# EAGLE design Adjustable Positive SupplyV3Switch (EAGLE 7.2.0)
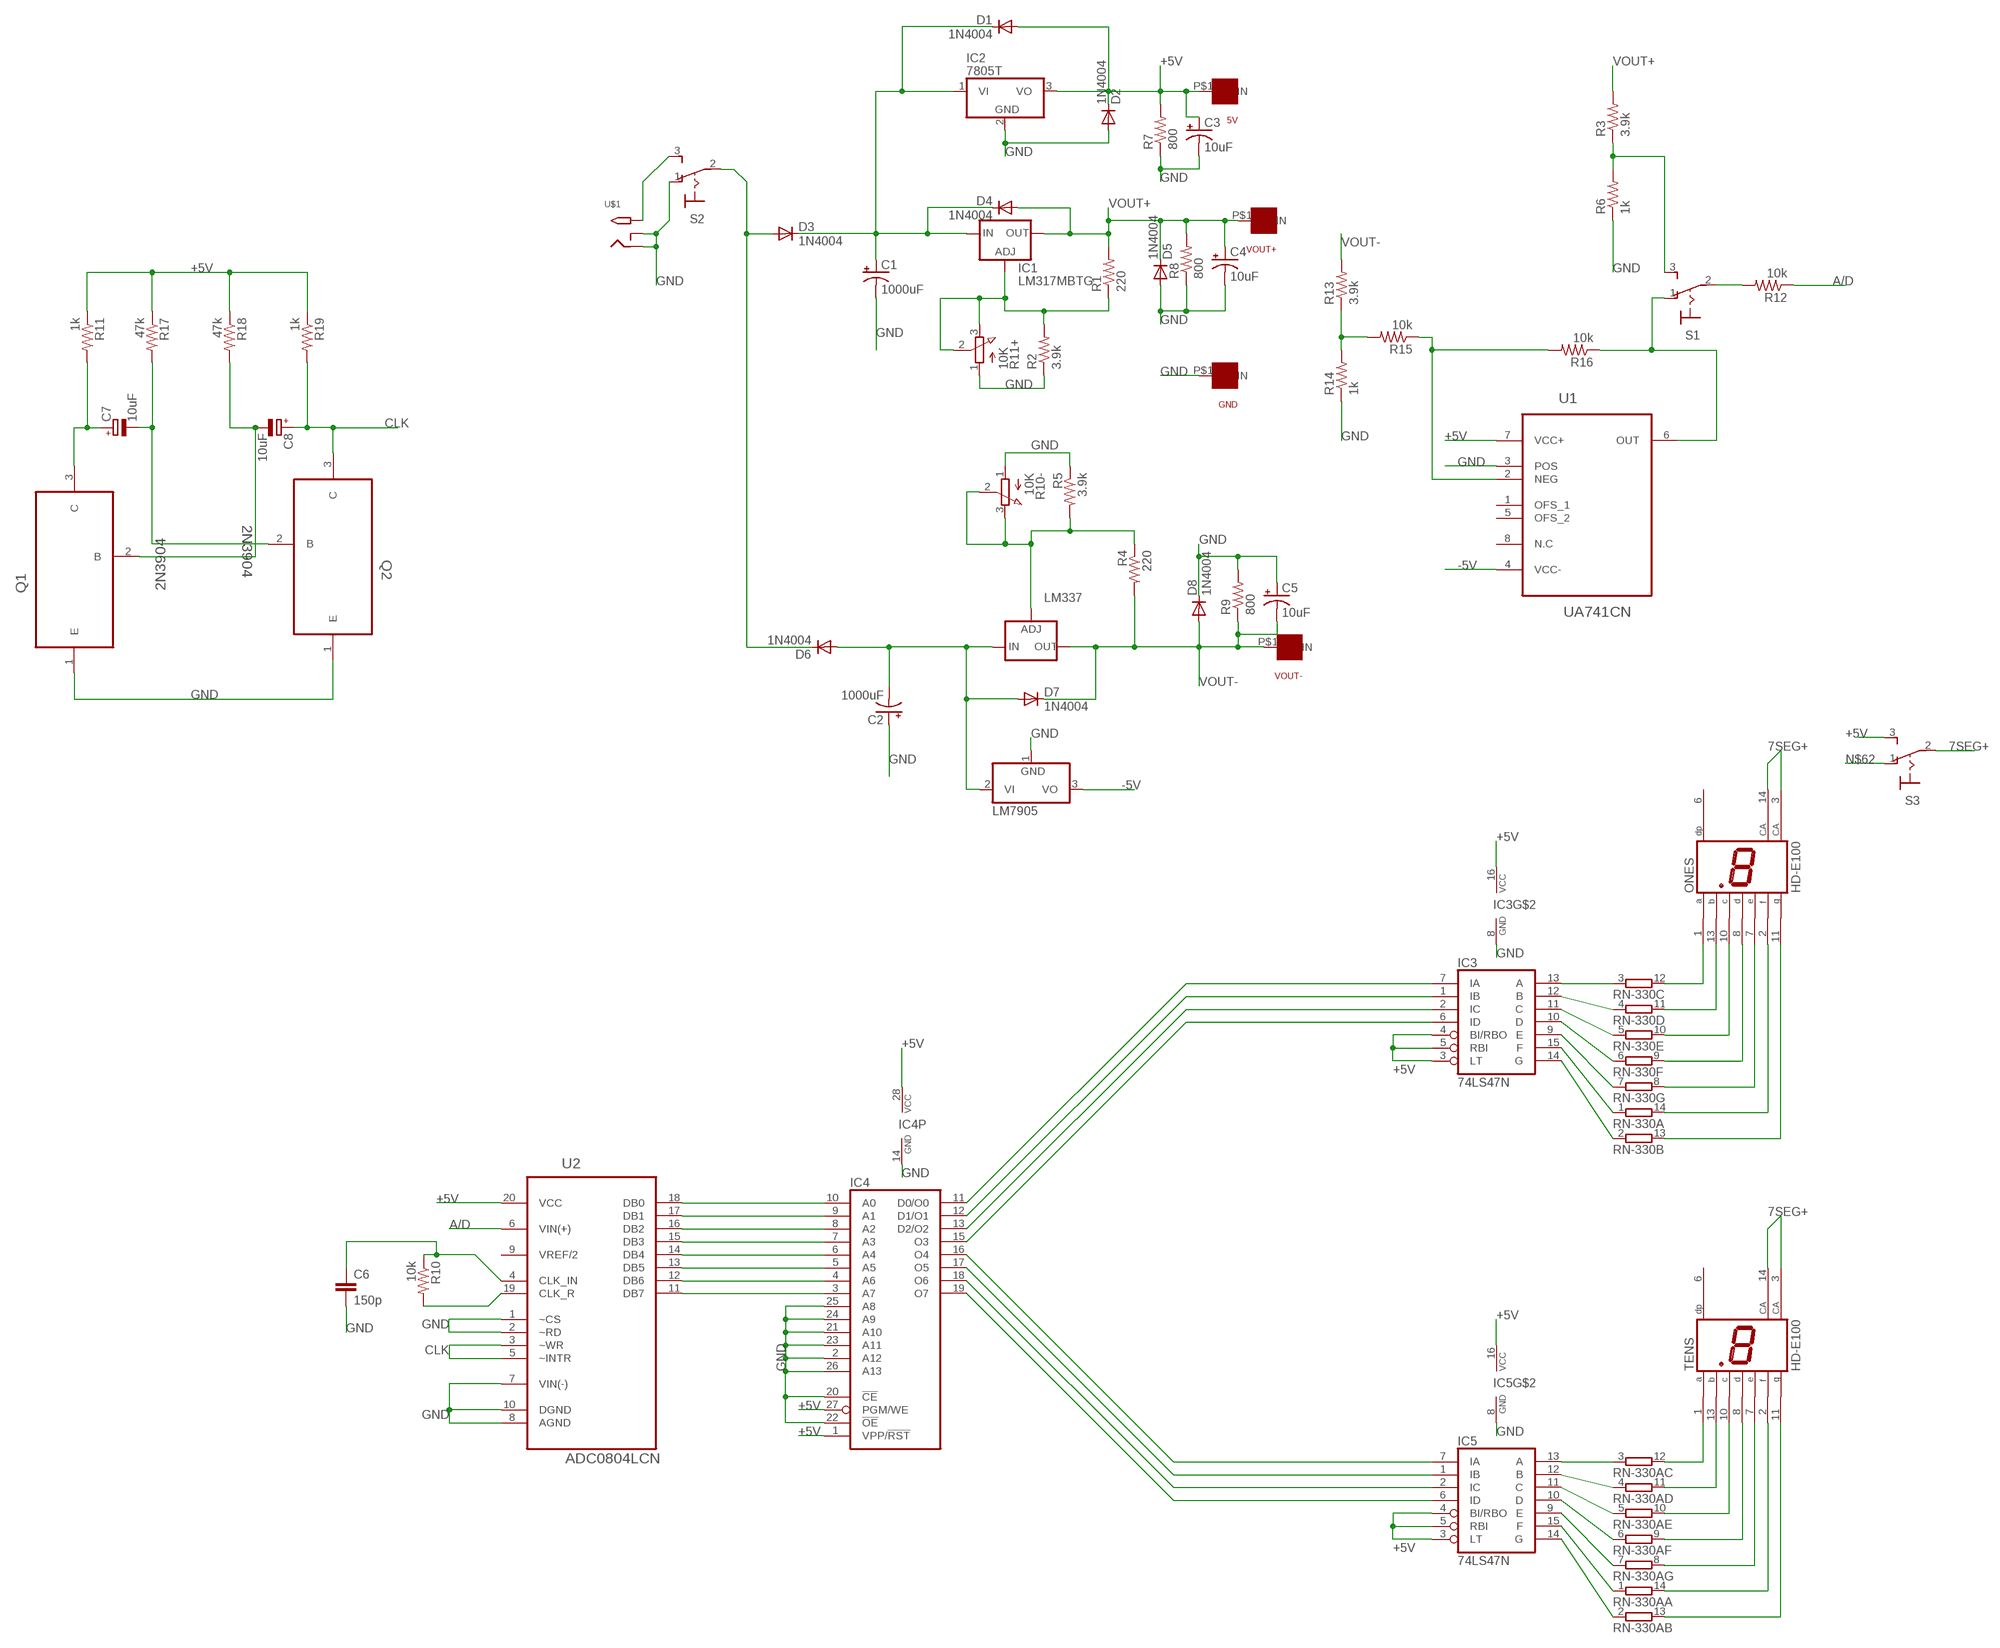
[diagram p0: schematic, sheet 1]

## Parts
5V  TURRENT_TERMINAL  [TURRET_CONNECTOR]
C1  1000uF  CPOL-USE7.5-16  [E7,5-16]
C2  1000uF  CPOL-USE7.5-16  [E7,5-16]
C3  10uF  CPOL-USE2.5-5  [E2,5-5]
C4  10uF  CPOL-USE2.5-5  [E2,5-5]
C5  10uF  CPOL-USE2.5-5  [E2,5-5]
C6  150p  C-EU025-025X050  [C025-025X050]
C7  10uF  CPOL-EUB45181B  [B45181B]
C8  10uF  CPOL-EUB45181B  [B45181B]
D1  1N4004  [DO41-10]
D2  1N4004  [DO41-10]
D3  1N4004  [DO41-10]
D4  1N4004  [DO41-10]
D5  1N4004  [DO41-10]
D6  1N4004  [DO41-10]
D7  1N4004  [DO41-10]
D8  1N4004  [DO41-10]
GND  TURRENT_TERMINAL  [TURRET_CONNECTOR]
IC1  LM317MBTG  [TO220L1]
IC2  7805T  [TO220H]
IC3  74LS47N  [DIL16]
IC4  27011  [DIL28]
IC5  74LS47N  [DIL16]
LM337  LM337TL  [337TL]
LM7905  7905T  [TO220H]
ONES  HD-E100  [HDSP-I]
Q1  2N3904  [TO254P508X877-3]
Q2  2N3904  [TO254P508X877-3]
R1  220  R-US_0411/15  [0411/15]
R2  3.9k  R-US_0411/15  [0411/15]
R3  3.9k  R-US_0411/15  [0411/15]
R4  220  R-US_0411/15  [0411/15]
R5  3.9k  R-US_0411/15  [0411/15]
R6  1k  R-US_0411/15  [0411/15]
R7  800  R-US_0411/15  [0411/15]
R8  800  R-US_0411/15  [0411/15]
R9  800  R-US_0411/15  [0411/15]
R10  10k  R-US_0411/15  [0411/15]
R10-  10K  EVUE2A  [EVUE]
R11  1k  R-US_0411/15  [0411/15]
R11+  10K  EVUE2A  [EVUE]
R12  10k  R-US_0411/15  [0411/15]
R13  3.9k  R-US_0411/15  [0411/15]
R14  1k  R-US_0411/15  [0411/15]
R15  10k  R-US_0411/15  [0411/15]
R16  10k  R-US_0411/15  [0411/15]
R17  47k  R-US_0411/15  [0411/15]
R18  47k  R-US_0411/15  [0411/15]
R19  1k  R-US_0411/15  [0411/15]
RN-330  7R-N  [DIL14]
RN-330A  7R-N  [DIL14]
S1  M9040P  [M9040P]
S2  M9040P  [M9040P]
S3  M9040P  [M9040P]
TENS  HD-E100  [HDSP-I]
U1  UA741CN  [DIP254P762X533-8]
U2  ADC0804LCN  [DIP254P762X508-20]
U$1  2.1MMJACKTHM  [PJ-102A]
VOUT+  TURRENT_TERMINAL  [TURRET_CONNECTOR]
VOUT-  TURRENT_TERMINAL  [TURRET_CONNECTOR]

## Nets
7SEG+: ONES.3(CA) ONES.14(CA) S3.2(P) TENS.3(CA) TENS.14(CA)
+5V [Power/GND]: 5V.P$1(IN) C3.+ D1.A D2.C IC2.3(VO) IC3.3(LT) IC3.4(BI/RBO) IC3.5(RBI) IC3.16(VCC) IC4.1(VPP/!RST) IC4.27(PGM/WE) IC4.28(VCC) IC5.3(LT) IC5.4(BI/RBO) IC5.5(RBI) IC5.16(VCC) R7.2 R11.1 R17.1 R18.1 R19.1 S3.3(S) U1.7(VCC+) U2.20(VCC)
-5V: LM7905.3(VO) U1.4(VCC-)
A/D: R12.1 U2.6(VIN(+))
CLK: C8.+ Q2.3(C) R19.2 U2.3(~WR) U2.5(~INTR)
GND [Power/GND]: C1.- C2.+ C3.- C4.- C5.+ C6.2 D2.A D5.A D8.C GND.P$1(IN) IC2.2(GND) IC3.8(GND) IC4.2(A12) IC4.14(GND) IC4.20(!CE) IC4.21(A10) IC4.22(!OE) IC4.23(A11) IC4.24(A9) IC4.25(A8) IC4.26(A13) IC5.8(GND) LM7905.1(GND) Q1.1(E) Q2.1(E) R2.1 R5.1 R6.1 R7.1 R8.1 R9.2 R10-.1(A) R11+.1(A) R14.1 S2.1(O) U1.3(POS) U2.1(~CS) U2.2(~RD) U2.7(VIN(-)) U2.8(AGND) U2.10(DGND) U$1.RING U$1.RING_SW
N$1: R12.2 S1.2(P)
N$2 [Power/GND]: D3.A D6.C S2.2(P)
N$3 [Power/GND]: C1.+ D1.C D3.C D4.C IC1.3(IN) IC2.1(VI)
N$4: IC1.1(ADJ) R1.1 R2.2 R11+.2(S) R11+.3(E)
N$5: R3.1 R6.2 S1.3(S)
N$6: LM337.1(ADJ) R4.1 R5.2 R10-.2(S) R10-.3(E)
N$7: R13.1 R14.2 R15.2
N$8: R15.1 R16.2 U1.2(NEG)
N$9 [Power/GND]: C2.- D6.A D7.A LM337.2(IN) LM7905.2(VI)
N$10: R16.1 S1.1(O) U1.6(OUT)
N$11: IC4.16(O4) IC5.7(IA)
N$12: IC4.18(O6) IC5.2(IC)
N$13: IC4.19(O7) IC5.6(ID)
N$14: IC3.7(IA) IC4.11(D0/O0)
N$15: IC3.1(IB) IC4.12(D1/O1)
N$16: IC3.2(IC) IC4.13(D2/O2)
N$17: IC3.6(ID) IC4.15(O3)
N$18: IC3.15(F) RN-330.1
N$19: IC3.14(G) RN-330.2
N$20: IC3.13(A) RN-330.3
N$21: IC3.12(B) RN-330.4
N$22: IC3.11(C) RN-330.5
N$23: IC3.10(D) RN-330.6
N$24: IC3.9(E) RN-330.7
N$25: ONES.1(A) RN-330.12
N$26: ONES.13(B) RN-330.11
N$27: ONES.10(C) RN-330.10
N$28: ONES.8(D) RN-330.9
N$29: ONES.7(E) RN-330.8
N$30: RN-330A.8 TENS.7(E)
N$31: ONES.2(F) RN-330.14
N$32: IC5.15(F) RN-330A.1
N$33: IC5.14(G) RN-330A.2
N$34: IC5.13(A) RN-330A.3
N$35: IC5.12(B) RN-330A.4
N$36: ONES.11(G) RN-330.13
N$37: IC5.11(C) RN-330A.5
N$38: IC5.10(D) RN-330A.6
N$39: IC5.9(E) RN-330A.7
N$40: IC4.17(O5) IC5.1(IB)
N$41: RN-330A.12 TENS.1(A)
N$42: RN-330A.11 TENS.13(B)
N$43: RN-330A.10 TENS.10(C)
N$44: RN-330A.9 TENS.8(D)
N$45: RN-330A.14 TENS.2(F)
N$46: RN-330A.13 TENS.11(G)
N$47: IC4.10(A0) U2.18(DB0)
N$48: IC4.9(A1) U2.17(DB1)
N$49: IC4.8(A2) U2.16(DB2)
N$50: IC4.7(A3) U2.15(DB3)
N$51: IC4.6(A4) U2.14(DB4)
N$52: IC4.5(A5) U2.13(DB5)
N$53: IC4.4(A6) U2.12(DB6)
N$54: IC4.3(A7) U2.11(DB7)
N$55: R10.2 U2.19(CLK_R)
N$56: C6.1 R10.1 U2.4(CLK_IN)
N$57: C7.+ Q1.3(C) R11.2
N$58: C7.- Q2.2(B) R17.2
N$59 [Power/GND]: S2.3(S) U$1.TIP
N$60: C8.- Q1.2(B) R18.2
N$62: S3.1(O)
VOUT+ [Power/GND]: C4.+ D4.A D5.C IC1.2(OUT) R1.2 R3.2 R8.2 VOUT+.P$1(IN)
VOUT- [Power/GND]: C5.- D7.C D8.A LM337.3(OUT) R4.2 R9.1 R13.2 VOUT-.P$1(IN)
Unconnected: ONES.6(DP) TENS.6(DP) U1.1(OFS_1) U1.5(OFS_2) U1.8(N.C) U2.9(VREF/2)

## Library data of the parts
5V GND VOUT+ VOUT- = MyDevices:TURRENT_TERMINAL
C1 C2 = adafruit:CPOL-US: POLARIZED CAPACITOR, American symbol
C3-C5 = rcl:CPOL-US: POLARIZED CAPACITOR, American symbol
C6 = rcl:C-EU: CAPACITOR, European symbol
C7 C8 = rcl:CPOL-EU: POLARIZED CAPACITOR, European symbol
D1-D8 = adafruit:1N4004: DIODE General purpose 1N400x type rectifier (With bigger pads) http://www.ladyada.net/library/pcb/eaglelibrary.html
IC1 = v-reg:LM317?*: 500 mA Adjustable Output Positive Voltage Regulator Source: http://www.onsemi.co.jp .. LM317M-D.PDF
IC2 = adafruit:78*: Positive VOLTAGE REGULATOR Added bigger pads to the TO-92 package
IC3 IC5 = 74xx-eu:74*47: BCD to seven segment DECODER/DRIVER Source: http://www.ee.washington.edu/stores/DataSheets/74ls/74ls47.pdf
IC4 = memory:27011: MEMORY
LM337 = v-reg:LM337TL: VOLTAGE REGULATOR
LM7905 = linear:79*: Negative VOLTAGE REGULATOR
ONES TENS = display-hp:HD-E100: LED DISPLAY 1-character 7 segment, decimal point left; OC_FARNELL: unknown; OC_NEWARK: unknown
Q1 Q2 = Fairchild_By_element14_Batch_1:2N3904: NPN General Purpose Amplifier; MPN: 2N3904; OC_FARNELL: 9846743; OC_NEWARK: -; PACKAGE: TO-92; SUPPLIER: Fairchild
R1-R19 = adafruit:R-US_: RESISTOR, American symbol
R10- R11+ = pot:EVU: 9 mm Square Rotary Potentiometers Source: Panasonic
RN-330 RN-330A = resistor-dil:7R-N: DIL RESISTOR; OC_FARNELL: unknown; OC_NEWARK: unknown
S1-S3 = switch:M9040P: TOGGLE SWITCH Marquardt
U1 = ST Microelctronics_By_element14_Batch_1:UA741CN: operational amplifiers; MPN: UA741CN; OC_FARNELL: 1094414; OC_NEWARK: 89K1126; PACKAGE: DIP; SUPPLIER: STMICROELECTRONICS
U2 = NSC_By_element14_Batch_1.1:ADC0804LCN: A/D Converter; MPN: ADC0804LCN; OC_FARNELL: 9486593; OC_NEWARK: 07B4596; PACKAGE: 20-DIP; SUPPLIER: National Semiconductor
U$1 = adafruit:2.1MMJACK: 2.1mm x 5.5mm THM DC jack with internal switch. Digikey part #PJ-102A, 4UCON part #05537 2.1mm x 5.5mm SMT DC jack with internal switch. Digikey part #PJ-002A-SMT, 4UCON part #03267 By microbuilder.eu & adafruit.com

## Net classes
1 Power/GND: width 0.508 mm, clearance 0.254 mm

## Board
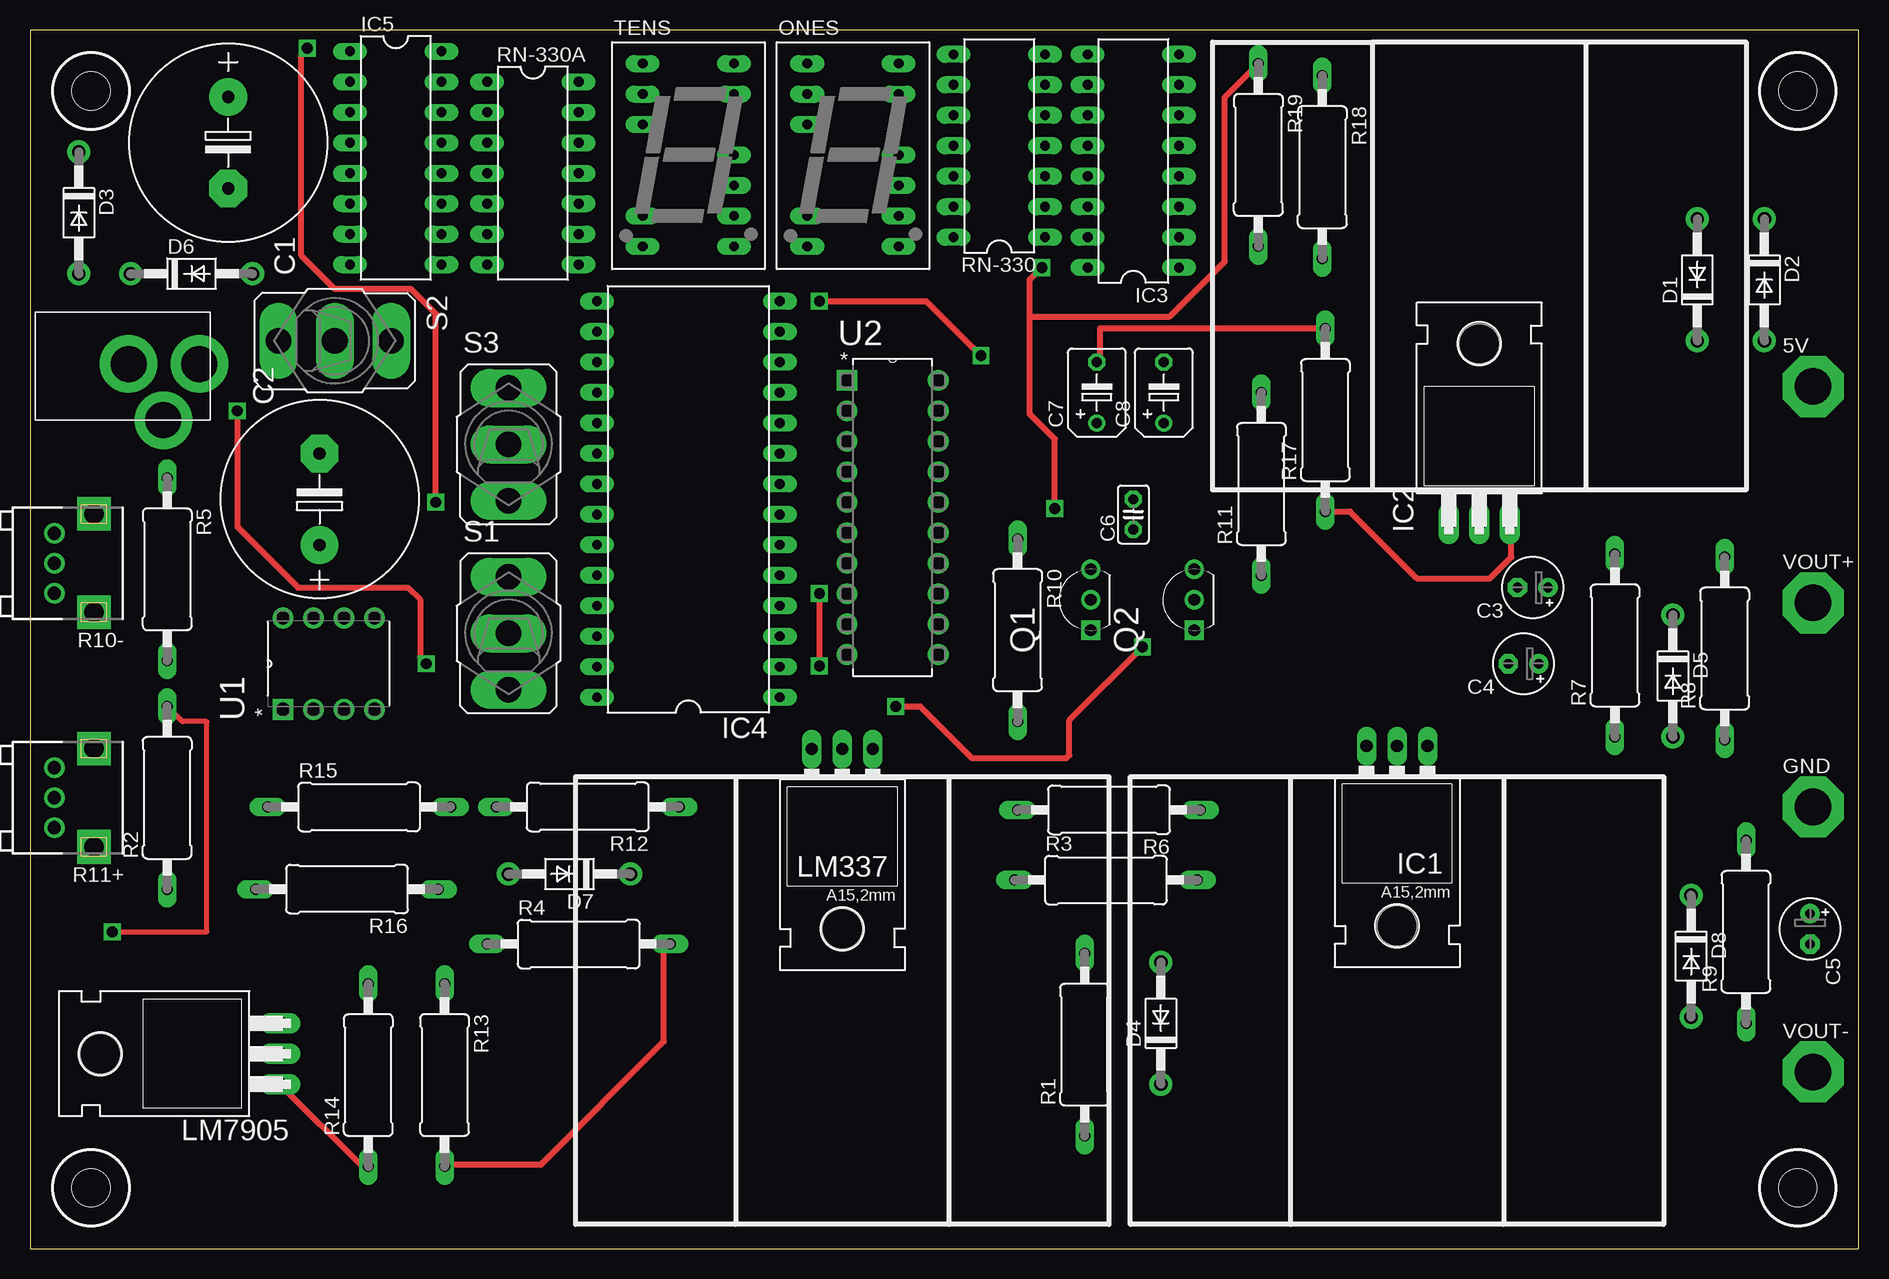
[diagram p1: board, top side]
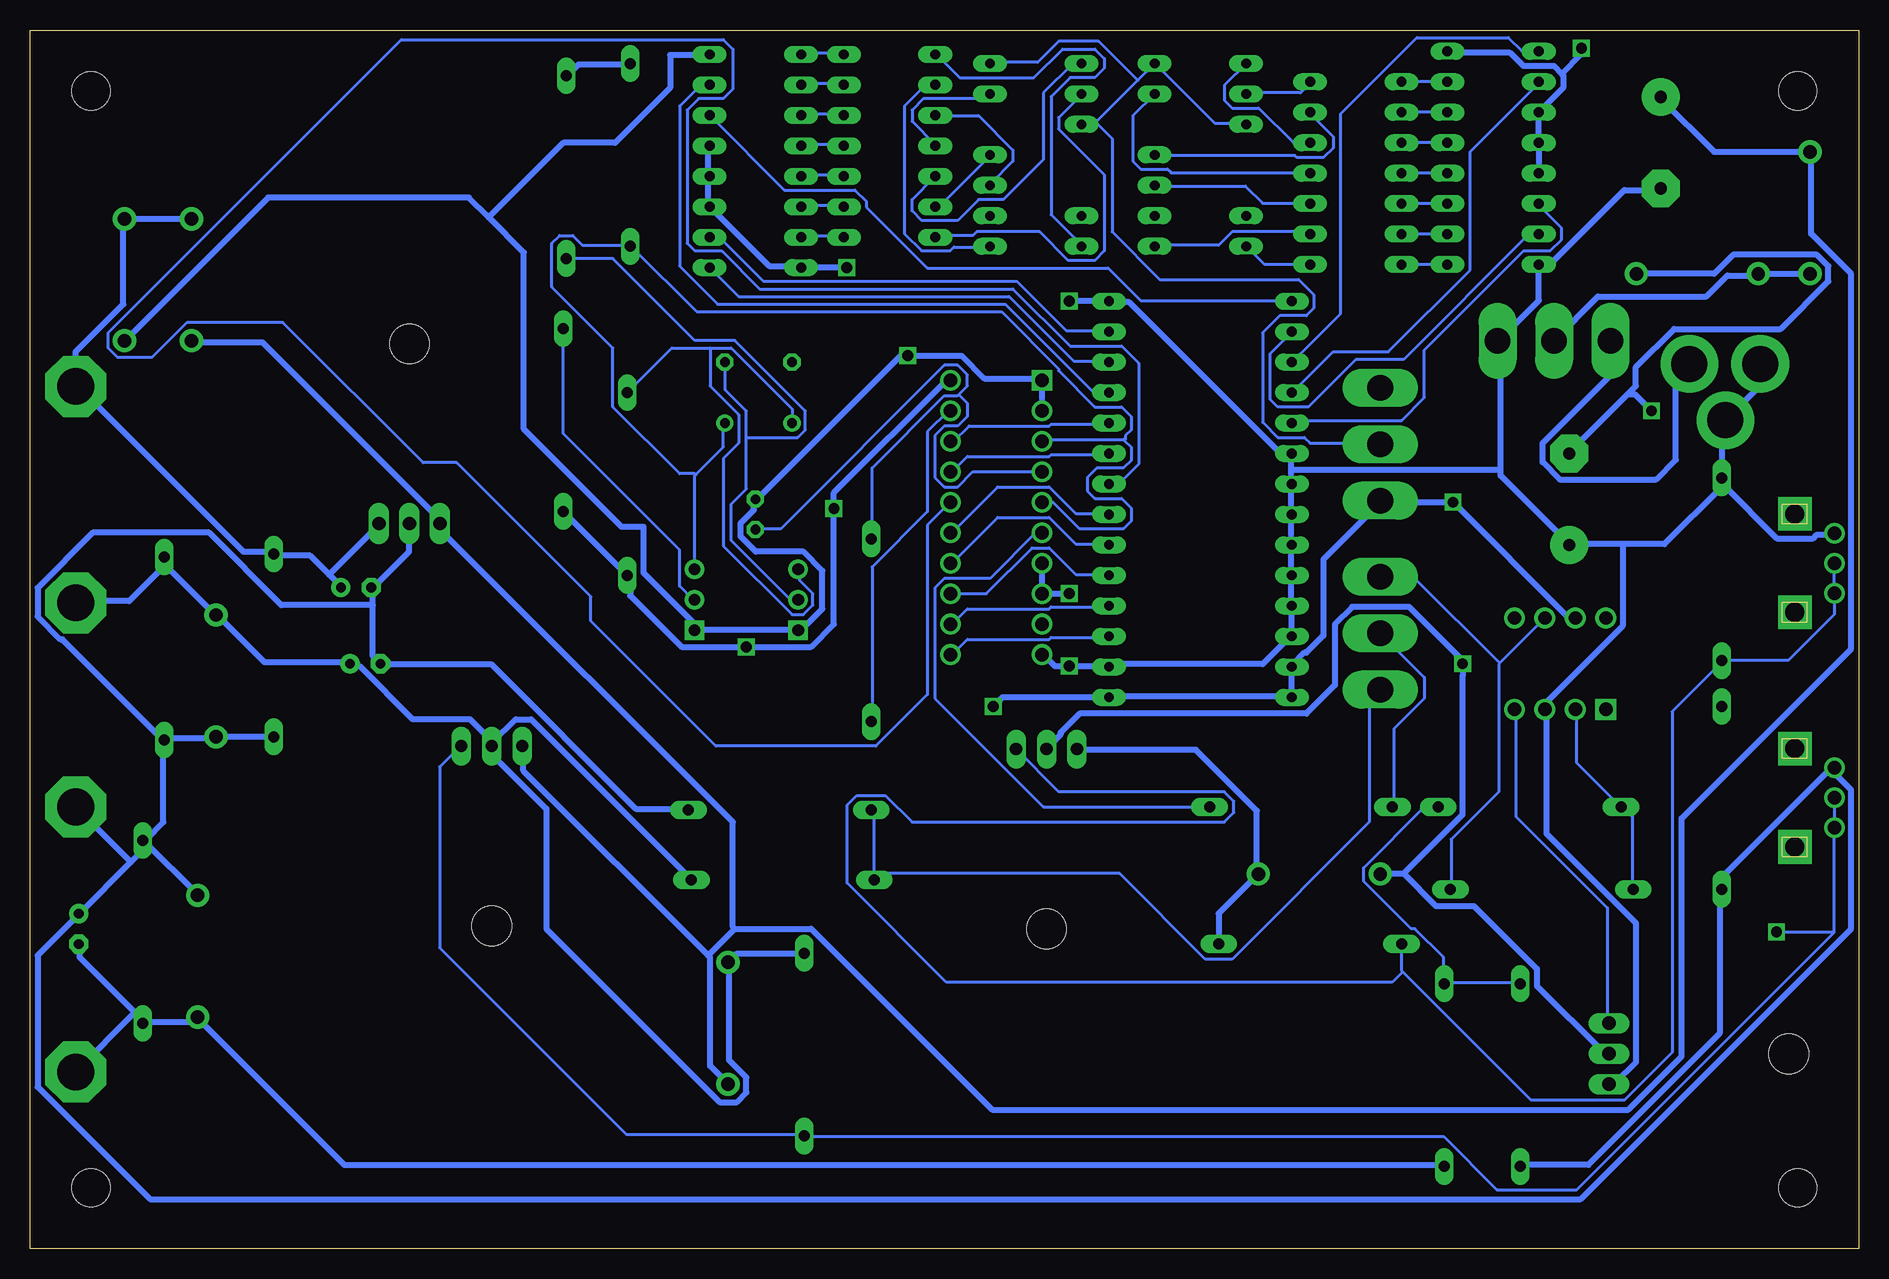
[diagram p2: board, bottom side, seen from below]

Size 152.4 x 101.6 mm. Coordinates in mm from the lower left corner, seen from the top.
Outline: 0,0 152.4,0 152.4,101.6 0,101.6 0,0
Copper layers (1*16): Top 0.035mm / dielectric 1.5mm / Bottom 0.035mm
Design rules "SparkFun *": minimum track width 10mil, minimum drill 20mil, track to track 15mil, track to pad 10mil, pad to pad 8mil, via to via 10mil, smd to smd 8mil, copper to edge 10mil, drill to drill 8mil, minimum pad ring 12mil, minimum via ring 10mil, stop-mask expansion 4mil, vias tented up to drill 25mil, thermal gap 10mil
Holes 3.17 mm at 147.32,5.08 5.08,5.08 5.08,96.52 147.32,96.52
tRestrict: area 58.4,2.5 to 77.5,39.4; area 104.1,2.5 to 123.2,39.4; area 111.8,63.5 to 129.5,100.3

### Footprints (pad centres in the part's own frame; a part is rotated, then mirrored left to right if it is on the bottom)
TURRET_CONNECTOR = drill 3.048 pad 5.08 octagon: P$1 0,0
E7,5-16 = drill 1.016 pad 3.15: + -3.81,0 | drill 1.016 pad 3.15 octagon: - 3.81,0
E2,5-5 = drill 0.813 pad 1.6: + -1.27,0 | drill 0.813 pad 1.6 octagon: - 1.27,0
C025-025X050 = drill 0.813 octagon: 1 -1.27,0; 2 1.27,0
B45181B = drill 0.813: + -2.54,0 | drill 0.813 octagon: - 2.54,0
DO41-10 = drill 1.118 pad 1.93: A 5.08,0; C -5.08,0
TO220L1 = drill 1.016 long: 1 -2.54,-3.81; 2 0,-3.81; 3 2.54,-3.81 | hole 3.302: 0,11.176
TO220H = drill 1.118 long: 1 -2.54,-10.16; 2 0,-10.16; 3 2.54,-10.16 | hole 3.302: 0,4.826
DIL16 = drill 0.813 long: 1 -8.89,-3.81; 2 -6.35,-3.81; 3 -3.81,-3.81; 4 -1.27,-3.81; 5 1.27,-3.81; 6 3.81,-3.81; 7 6.35,-3.81; 8 8.89,-3.81; 9 8.89,3.81; 10 6.35,3.81; 11 3.81,3.81; 12 1.27,3.81; 13 -1.27,3.81; 14 -3.81,3.81; 15 -6.35,3.81; 16 -8.89,3.81
DIL28 = drill 0.813 long: 1 -16.51,-7.62; 2 -13.97,-7.62; 3 -11.43,-7.62; 4 -8.89,-7.62; 5 -6.35,-7.62; 6 -3.81,-7.62; 7 -1.27,-7.62; 8 1.27,-7.62; 9 3.81,-7.62; 10 6.35,-7.62; 11 8.89,-7.62; 12 11.43,-7.62; 13 13.97,-7.62; 14 16.51,-7.62; 15 16.51,7.62; 16 13.97,7.62; 17 11.43,7.62; 18 8.89,7.62; 19 6.35,7.62; 20 3.81,7.62; 21 1.27,7.62; 22 -1.27,7.62; 23 -3.81,7.62; 24 -6.35,7.62; 25 -8.89,7.62; 26 -11.43,7.62; 27 -13.97,7.62; 28 -16.51,7.62
337TL = drill 1.016 long: 1 -2.54,-3.81; 2 0,-3.81; 3 2.54,-3.81 | hole 3.302: 0,11.176
HDSP-I = drill 0.813 long: 1 -3.81,7.62; 2 -3.81,5.08; 3 -3.81,2.54; 6 -3.81,-5.08; 7 -3.81,-7.62; 8 3.81,-7.62; 9 3.81,-5.08; 10 3.81,-2.54; 11 3.81,0; 13 3.81,5.08; 14 3.81,7.62
TO254P508X877-3 = drill 0.991 square: 1 -5.08,0 | drill 0.991: 2 -2.54,0; 3 0,0
0411/15 = drill 0.914 long: 1 -7.62,0; 2 7.62,0
EVUE = drill 1.1 pad 1.676: 1 0,-2.5; 2 0,0; 3 0,2.5 | drill 1.6 pad 2.8 square: M1 -3.3,4.1; M2 -3.3,-4.1
DIL14 = drill 0.813 long: 1 -7.62,-3.81; 2 -5.08,-3.81; 3 -2.54,-3.81; 4 0,-3.81; 5 2.54,-3.81; 6 5.08,-3.81; 7 7.62,-3.81; 8 7.62,3.81; 9 5.08,3.81; 10 2.54,3.81; 11 0,3.81; 12 -2.54,3.81; 13 -5.08,3.81; 14 -7.62,3.81
M9040P = drill 2.134 long: 1 0,4.699; 2 0,0; 3 0,-4.699
DIP254P762X533-8 = drill 1.118 square: 1 -7.62,7.62 | drill 1.118: 2 -7.62,5.08; 3 -7.62,2.54; 4 -7.62,0; 5 0,0; 6 0,2.54; 7 0,5.08; 8 0,7.62
DIP254P762X508-20 = drill 1.118 square: 1 -7.62,22.86 | drill 1.118: 2 -7.62,20.32; 3 -7.62,17.78; 4 -7.62,15.24; 5 -7.62,12.7; 6 -7.62,10.16; 7 -7.62,7.62; 8 -7.62,5.08; 9 -7.62,2.54; 10 -7.62,0; 11 0,0; 12 0,2.54; 13 0,5.08; 14 0,7.62; 15 0,10.16; 16 0,12.7; 17 0,15.24; 18 0,17.78; 19 0,20.32; 20 0,22.86
PJ-102A = drill 3 pad 4.8: RING 0.1,-3.39; RING_SW -4.6,-6.29; TIP 0.1,-9.29

### Placement (x,y rotation side)
5V  148.59,71.88 0 top
C1  16.51,92.2 270 top
C2  24.13,62.48 90 top
C3  125.22,55.12 180 top
C4  124.46,48.77 180 top
C5  148.34,26.67 270 top
C6  91.95,61.21 90 top
C7  88.9,71.37 90 top
C8  94.49,71.37 90 top
D1  138.94,80.77 90 top
D2  144.53,80.77 270 top
D3  4.06,86.36 270 top
D4  94.23,18.8 90 top
D5  136.91,47.75 270 top
D6  13.46,81.28 0 top
D7  44.96,31.24 180 top
D8  138.43,24.38 270 top
GND  148.59,36.83 0 top
IC1  113.92,38.1 180 top
IC2  120.78,70.61 0 top
IC3  91.95,90.68 90 top
IC4  54.86,62.48 90 top
IC5  30.48,90.93 270 top
LM337  67.69,37.85 180 top
LM7905  10.67,16.26 90 top
ONES  68.58,91.19 0 top
Q1  88.39,56.64 90 top
Q2  97.03,56.64 90 top
R1  87.88,17.02 90 top
R2  11.43,37.59 90 top
R3  89.66,30.73 0 top
R4  45.72,25.4 0 top
R5  11.43,56.64 270 top
R6  89.92,36.58 180 top
R7  132.08,50.29 90 top
R8  141.22,50.04 90 top
R9  143,26.42 90 top
R10  82.3,51.56 270 top
R10-  2.03,57.15 180 top
R11  102.62,63.75 90 top
R11+  2.03,37.59 180 top
R12  46.48,36.83 180 top
R13  34.54,14.48 270 top
R14  28.19,14.48 90 top
R15  27.43,36.83 0 top
R16  26.42,29.97 180 top
R17  107.95,69.09 90 top
R18  107.7,90.17 270 top
R19  102.36,91.19 270 top
RN-330  80.77,91.95 90 top
RN-330A  41.91,89.66 270 top
S1  39.88,51.31 0 top
S2  25.4,75.69 270 top
S3  39.88,67.06 0 top
TENS  54.86,91.19 0 top
U1  28.7,52.58 90 top
U2  75.69,49.53 0 top
U$1  4.83,73.66 90 top
VOUT+  148.59,53.85 0 top
VOUT-  148.59,14.73 0 top

### Tracks (layer width: path | path; a pad name or v marks a point on that pad's centre or on a via)
7SEG+
  Bottom 0.254: TENS.3 51.12,93.82 53.66,93.82 58.58,98.74 TENS.14 60.09,97.39 | 60.09,97.39 63.66,93.82 64.77,93.82 ONES.3 63.5,93.82 62.23,92.55 62.23,84.77 58.26,80.8 46.67,80.8 45.4,79.53 45.4,78.42 46.04,77.79 48.26,77.79 49.69,76.36 49.69,68.9 48.42,67.63 46.2,67.63 45.72,67.15 40.01,67.15 S3.2 | 60.09,97.39 63.34,100.65 66.67,100.65 68.42,98.9 72.39,98.9 ONES.14
+5V  (via drill 0.9)
  Top 0.508: v33.81,62.23 33.81,77.95 31.75,80.01 25.4,80.01 22.61,82.8 22.61,99.57 v23.11,100.08 | v72.14,45.21 74.17,45.21 78.49,40.89 86.36,40.89 86.61,41.15 86.61,44.07 v92.71,50.16 | v85.41,61.7 85.41,67.5 83.31,69.6 83.31,77.72 | 83.31,77.72 83.31,80.77 v84.33,81.79 | R17.1 109.98,61.47 115.57,55.88 121.67,55.88 123.44,57.66 123.44,60.33 IC2.3 | 83.31,77.72 95,77.72 99.57,82.3 99.57,96.01 R19.1
  Bottom 0.508: 127.48,56.2 126.52,55.24 C3.+ | 127.48,56.2 129.06,57.78 132.08,57.78 R7.2 132.24,58.1 134.62,58.1 148.43,71.91 5V.P$1 148.59,74.77 144.62,78.74 144.62,85.72 D2.C 144.46,85.88 139.06,85.88 D1.A | 127.48,56.2 123.35,60.33 IC2.3 | R17.1 107.95,61.44 102.71,56.2 R11.1 102.39,56.04 102.39,54.45 98.11,50.16 v92.71,50.16 87.31,50.16 85.41,52.07 v85.41,61.7 85.41,63.02 76.04,72.39 U2.20 | U1.7 23.65,52.7 24.29,52.7 v33.81,62.23 39.85,62.23 S3.3 40.01,62.07 44.61,57.47 44.61,51.12 46.04,49.69 46.2,49.69 47.15,48.74 IC4.27 47.31,48.42 47.31,46.04 IC4.28 47.47,46.04 62.39,46.04 IC4.1 71.37,45.97 v72.14,45.21 | IC5.5 IC5.4 IC5.3 26.51,94.93 24.61,96.84 24.61,97.79 24.75,97.93 | 24.75,97.93 25.4,98.58 27.94,98.58 29.05,99.69 34.29,99.69 IC5.16 | IC3.5 95.89,91.92 95.89,89.53 IC3.4 95.89,89.38 95.89,87 IC3.3 90.81,81.92 88.27,81.92 IC3.16 v84.33,81.79 | R19.1 102.39,98.74 106.68,98.74 107.63,97.79 R18.1 | v23.11,100.08 23.11,99.57 24.75,97.93
-5V
  Bottom 0.254: LM7905.3 20.95,18.89 20.95,28.42 28.57,36.04 28.57,44.93 U1.4
A/D
  Bottom 0.254: R12.1 67.94,36.83 76.99,45.88 76.99,55.09 76.2,55.88 72.39,55.88 68.58,59.69 U2.6
CLK
  Bottom 0.254: U2.5 67.15,62.23 64.93,60.01 61.28,60.01 60.64,60.64 60.64,61.75 61.44,62.55 63.66,62.55 64.29,63.18 64.29,64.29 63.5,65.09 61.28,65.09 60.64,65.72 60.64,66.83 61.2,67.39 | 61.2,67.39 61.28,67.47 67.79,67.47 67.94,67.31 U2.3 | 96.92,64.53 97,64.45 97,56.67 Q2.3 | 96.92,64.53 94.61,66.83 94.61,68.74 C8.+ | 96.92,64.53 97,64.61 98.27,64.61 103.82,70.17 103.82,75.09 108.9,80.17 108.9,83.82 108.27,84.45 107.16,84.45 106.36,83.66 102.39,83.66 R19.2 102.23,83.5 96.84,78.11 71.44,78.11 66.67,73.34 66.67,73.18 63.66,70.17 61.44,70.17 60.64,69.37 60.64,68.26 61.12,67.79 61.12,67.47 61.2,67.39
GND  (via drill 0.9)
  Top 0.508: R14.1 27.69,6.86 LM7905.1 | v65.79,54.61 v65.79,48.58 | v65.79,78.99 74.71,78.99 v79.25,74.45
  Bottom 0.508: U2.7 68.1,57.15 68.1,54.61 U2.8 v65.79,54.61 | U2.10 67.94,49.53 66.99,48.58 v65.79,48.58 62.55,48.58 IC4.2 62.39,48.74 49.69,48.74 47.47,50.96 IC4.26 47.31,51.12 47.31,53.5 IC4.25 47.31,53.82 47.31,56.04 IC4.24 47.31,56.36 47.31,58.58 IC4.23 47.31,58.9 47.31,61.12 IC4.22 47.31,61.44 47.31,63.66 IC4.21 47.31,63.98 47.31,64.93 | 47.31,64.93 47.31,66.2 IC4.20 47.47,66.36 48.26,66.36 60.8,78.9 62.39,78.9 IC4.14 v65.79,78.99 | LM7905.1 20.8,13.81 20.32,13.81 18.57,15.56 18.57,27.15 26.04,34.61 26.04,44.93 U1.3 25.88,45.09 25.88,45.72 19.68,51.91 19.68,58.74 | C1.- 16.51,88.27 19.53,88.27 25.56,82.23 26.51,82.23 IC5.8 26.67,79.06 30,75.72 S2.1 29.84,75.56 29.84,64.93 | R5.1 11.43,68.9 11.27,69.06 U$1.RING_SW 10.95,69.22 8.26,71.91 8.26,73.66 U$1.RING | R10-.1 2.06,59.53 3.49,59.53 3.81,59.21 6.83,59.21 11.27,63.66 11.27,64.14 R5.1 | 19.68,58.74 16.19,58.74 11.43,63.5 R5.1 | 19.68,58.74 24.13,58.74 C2.+ 24.29,58.9 29.84,64.45 29.84,64.93 | 29.84,64.93 47.31,64.93 | R14.1 28.1,6.99 22.54,6.99 11.59,17.94 11.59,29.84 R2.1 11.43,30.96 2.38,40.01 2.06,40.01 R11+.1 1.91,39.85 1.91,39.53 0.64,38.26 0.64,26.67 23.18,4.13 142.4,4.13 151.76,13.49 151.76,24.45 148.43,27.78 C5.+ 148.27,27.94 143.99,32.23 | R8.1 141.13,42.55 137,42.55 D5.A 136.68,42.7 132.08,42.7 R7.1 | R9.2 142.88,33.97 138.43,29.53 D8.C | 143.99,32.23 142.72,33.5 R9.2 | R8.1 141.29,42.23 141.29,35.56 142.72,34.13 R9.2 | 143.99,32.23 GND.P$1 | R6.1 97.63,36.67 101.92,36.67 113.98,48.74 123.19,48.74 C4.- 123.35,48.9 123.83,49.37 123.83,53.66 | 123.83,53.66 123.83,55.09 C3.- 123.67,55.24 120.81,58.1 120.81,60.33 IC2.2
  Bottom 0.508: 123.83,53.66 131.44,53.66 137.48,59.69 147.16,59.69 151.76,55.09 151.76,52.7 149.86,50.8 149.7,50.8 141.45,42.55 R8.1 | U2.2 68.1,69.85 68.1,72.39 U2.1 68.26,72.55 72.87,72.55 74.77,74.45 v79.25,74.45 79.85,74.45 91.76,62.55 C6.2 92.08,62.39 92.08,61.59 93.19,60.48 93.19,59.37 91.92,58.1 87.95,58.1 86.36,56.52 86.36,53.34 88.27,51.44 Q1.1 88.58,51.59 97,51.59 Q2.1 97.16,51.75 97.16,52.23 101.28,56.36 101.28,60.17 103.09,60.17 111.25,68.33 111.25,83.06 114.17,85.98 | IC3.8 95.89,99.54 99.06,99.54 99.06,96.77 103.63,92.2 107.95,92.2 114.17,85.98 | D2.A 144.46,75.72 132.56,87.63 115.82,87.63 114.17,85.98
N$1
  Bottom 0.254: S1.2 36.2,47.62 36.2,45.88 38.73,43.34 38.73,36.83 R12.2
N$2
  Bottom 0.508: D3.A D6.C 8.57,81.12 10.95,81.12 12.7,79.38 21.75,79.38 25.4,75.72 S2.2
N$3
  Bottom 0.508: D1.C 138.91,75.56 133.03,75.56 118.27,60.8 118.27,60.48 IC2.1 118.11,60.33 118.11,59.85 93.82,35.56 93.82,26.83 93.66,26.67 | C1.+ 16.51,95.89 12.06,91.44 D3.C 3.97,91.28 3.97,84.61 0.64,81.28 0.64,50.01 14.76,35.88 14.76,16.03 19.21,11.59 72.23,11.59 87.31,26.67 93.66,26.67 | 95.89,24.45 95.73,24.29 95.73,15.24 94.3,13.81 D4.C | 95.89,24.45 111.28,39.85 111.28,41.91 IC1.3 | 95.89,24.45 93.66,26.67
N$4  (via drill 0.9)
  Top 0.406: v6.86,26.42 14.73,26.42 14.73,43.94 12.7,43.94 R2.2
  Bottom 0.254: R11+.2 2.06,37.47 2.06,35.24 R11+.3 2.06,35.08 2.06,26.35 | IC1.1 116.52,41.91 118.27,40.16 118.27,25.08 102.71,9.53 87.95,9.53 R1.1 87.79,9.37 34.61,9.37 30.16,4.92 23.5,4.92 2.06,26.35 | 2.06,26.35 6.86,26.35
  Bottom 0.406: 6.86,26.35 v6.86,26.42
N$5
  Bottom 0.254: 82.07,31.27 82.07,36.35 R6.2 | 82.07,31.27 82.07,30.8 R3.1 82.07,31.27 | 82.07,31.27 61.59,31.27 54.45,24.13 52.23,24.13 40.8,35.56 40.8,45.72 40.01,46.51 S1.3
N$6
  Bottom 0.254: R4.1 38.1,23.18 38.02,23.1 | 38.02,23.1 27.3,12.38 19.53,12.38 15.56,16.35 15.56,44.77 11.43,48.9 R5.2 11.43,49.05 5.87,49.05 2.06,52.86 2.06,54.61 R10-.3 2.06,54.77 2.06,57.15 R10-.2 | LM337.1 66.67,38.1 52.86,38.1 52.07,37.31 52.07,36.35 52.86,35.56 78.9,35.56 81.12,37.78 83.5,37.78 84.3,36.99 84.3,30.48 76.04,22.23 38.89,22.23 38.02,23.1
N$7
  Bottom 0.254: R14.2 28.26,22.23 34.45,22.23 R13.1 34.61,22.23 34.61,24.29 36.99,26.67 37.31,26.67 41.27,30.64 41.27,31.75 36.2,36.83 R15.2
N$8
  Bottom 0.254: R16.2 18.89,30 18.89,36.04 19.68,36.83 R15.1 19.84,36.83 23.5,40.48 23.5,44.93 U1.2
N$9  (via drill 0.9)
  Top 0.508: v17.27,69.85 17.27,60.2 22.35,55.12 31.5,55.12 32.51,54.1 32.51,49.28 v33.02,48.77
  Bottom 0.508: 37.94,31.27 33.02,36.2 33.02,47.75 v33.02,48.77 33.02,49.05 37.47,53.5 42.23,53.5 43.66,52.07 43.66,46.99 46.04,44.61 64.93,44.61 66.52,43.02 66.52,42.86 67.63,41.75 LM337.2 | 37.94,31.27 39.85,31.27 D7.A | 37.94,31.27 35.24,28.57 32.07,28.57 26.83,23.34 26.83,21.91 21.27,16.35 20.95,16.35 LM7905.2 | D6.A 12.06,81.28 10.48,82.87 3.49,82.87 2.54,81.92 2.54,80.64 6.51,76.68 15.4,76.68 18.57,73.5 18.57,71.91 19.25,71.24 | 19.25,71.24 24.13,66.36 C2.- | 19.25,71.24 18.66,71.24 v17.27,69.85
N$10
  Bottom 0.254: U1.6 29.92,48.82 | 29.92,48.82 30,48.74 30,38.1 33.97,34.13 33.97,30 R16.1 | 29.92,48.82 36.99,55.88 39.85,55.88 S1.1
N$11
  Bottom 0.254: IC4.16 47.31,76.36 49.05,74.61 49.05,70.8 48.42,70.17 45.88,70.17 41.91,74.14 37.94,74.14 27.62,84.45 26.67,84.45 IC5.7
N$12
  Bottom 0.254: IC5.2 26.67,97.16 32.38,91.44 32.38,81.6 39.21,74.77 43.81,74.77 47.15,71.44 IC4.18
N$13
  Bottom 0.254: IC5.6 26.67,87 24.77,85.09 24.77,84.14 25.72,83.19 27.94,83.19 36.2,74.93 36.2,70.96 38.1,69.06 46.99,69.06 47.15,68.9 IC4.19
N$14
  Bottom 0.254: IC4.11 62.55,71.44 63.82,71.44 71.12,78.74 95.09,78.74 98.27,81.92 98.27,95.25 96.52,97 95.89,97 IC3.7
N$15
  Bottom 0.254: IC3.1 93.34,79.38 70.8,79.38 65.41,73.98 62.55,73.98 IC4.12
N$16
  Bottom 0.254: IC4.13 62.55,76.52 66.04,76.52 70.17,80.64 91.28,80.64 94.93,84.3 95.73,84.3 IC3.2
N$17
  Bottom 0.254: IC3.6 89.53,88.27 83.66,88.27 82.71,87.31 82.71,86.84 77.63,81.76 62.55,81.76 59.85,79.06 47.31,79.06 IC4.15
N$18
  Bottom 0.254: RN-330.1 84.61,84.45 88.11,84.45 IC3.15
N$19
  Bottom 0.254: RN-330.2 84.61,87 88.11,87 IC3.14
N$20
  Bottom 0.254: RN-330.3 84.61,89.53 88.11,89.53 IC3.13
N$21
  Bottom 0.254: RN-330.4 84.61,92.08 88.11,92.08 IC3.12
N$22
  Bottom 0.254: RN-330.5 84.61,94.61 88.11,94.61 IC3.11
N$23
  Bottom 0.254: RN-330.6 84.61,97.16 88.11,97.16 IC3.10
N$24
  Bottom 0.254: RN-330.7 84.61,99.69 88.11,99.69 IC3.9
N$25
  Bottom 0.254: RN-330.12 78.9,87.47 78.9,86.52 78.11,85.72 75.09,85.72 73.34,87.47 71.28,87.47 67.94,90.81 67.94,96.36 65.56,98.74 64.77,98.74 ONES.1
N$26
  Bottom 0.254: RN-330.11 76.99,92.08 78.9,93.98 78.9,94.93 77.95,95.89 72.71,95.89 72.39,96.2 ONES.13
N$27
  Bottom 0.254: ONES.10 72.39,88.74 70.48,90.65 70.48,91.6 73.34,94.46 76.83,94.46 RN-330.10
N$28
  Bottom 0.254: ONES.8 72.39,83.5 75.41,83.5 75.72,83.19 78.11,83.19 79.53,84.61 79.53,95.25 77.79,97 76.99,97 RN-330.9
N$29
  Bottom 0.254: ONES.7 64.77,83.66 67.31,86.2 67.31,96.04 65.72,97.63 63.66,97.63 62.87,98.42 62.87,99.22 63.66,100.01 66.36,100.01 68.74,97.63 74.93,97.63 76.83,99.54 RN-330.8
N$30
  Bottom 0.254: RN-330A.8 45.72,82.07 49.53,82.07 50.96,83.5 TENS.7
N$31
  Bottom 0.254: RN-330.14 76.83,84.45 73.82,84.45 73.5,84.77 68.26,84.77 65.88,82.39 63.66,82.39 62.87,83.19 62.87,89.53 66.67,93.34 66.67,94.3 64.77,96.2 ONES.2
N$32
  Bottom 0.254: IC5.15 34.29,97.31 38.1,97.31 RN-330A.1
N$33
  Bottom 0.254: IC5.14 34.29,94.77 38.1,94.77 RN-330A.2
N$34
  Bottom 0.254: IC5.13 34.29,92.23 38.1,92.23 RN-330A.3
N$35
  Bottom 0.254: IC5.12 34.29,89.69 38.1,89.69 RN-330A.4
N$36
  Bottom 0.254: RN-330.13 76.83,87 76.52,87 72.39,91.12 ONES.11
N$37
  Bottom 0.254: IC5.11 34.29,87.15 38.1,87.15 RN-330A.5
N$38
  Bottom 0.254: IC5.10 34.29,84.61 38.1,84.61 RN-330A.6
N$39
  Bottom 0.254: IC5.9 34.29,82.07 38.1,82.07 RN-330A.7
N$40
  Bottom 0.254: IC5.1 26.67,99.85 28.1,99.85 29.21,100.97 36.83,100.97 43.18,94.61 43.18,77.95 47.15,73.98 IC4.17
N$41
  Bottom 0.254: TENS.1 52.86,97 52.86,95.73 52.23,95.09 50.01,95.09 47.15,92.23 45.72,92.23 RN-330A.12
N$42
  Bottom 0.254: TENS.13 60.48,94.46 60.48,90.65 59.85,90.01 57.63,90.01 57.31,89.69 45.72,89.69 RN-330A.11
N$43
  Bottom 0.254: RN-330A.10 45.72,87.15 49.69,87.15 51.12,88.58 58.58,88.58 TENS.10
N$44
  Bottom 0.254: TENS.8 58.58,83.66 53.34,83.66 52.23,84.77 45.88,84.77 45.72,84.61 RN-330A.9
N$45
  Bottom 0.254: TENS.2 50.96,96.36 46.51,96.36 45.72,97.16 RN-330A.14
N$46
  Bottom 0.254: TENS.11 58.58,91.12 46.99,91.12 46.83,90.96 44.61,90.96 43.81,91.76 43.81,92.71 45.72,94.61 RN-330A.13
N$47
  Bottom 0.254: U2.18 75.41,67.31 74.14,68.58 67.47,68.58 67.31,68.74 62.55,68.74 IC4.10
N$48
  Bottom 0.254: IC4.9 62.55,66.2 67.31,66.2 67.47,66.04 74.3,66.04 75.56,64.77 U2.17
N$49
  Bottom 0.254: IC4.8 62.39,63.82 61.59,63.82 60.01,65.41 60.01,73.82 61.44,75.25 65.72,75.25 70.48,80.01 91.6,80.01 94.77,83.19 97,83.19 97.63,83.82 97.63,94.93 96.68,95.89 94.61,95.89 93.82,96.68 93.82,100.01 94.61,100.81 121.44,100.81 145.89,76.36 145.89,75.09 145.1,74.3 142.24,74.3 139.32,77.22 131.32,77.22 119.63,65.53 116.84,65.53 105.66,54.36 105.66,52.32 95.25,41.91 81.92,41.91 77.63,46.2 77.63,60.33 75.72,62.23 U2.16
N$50
  Bottom 0.254: IC4.7 62.55,61.28 65.25,61.28 67.47,63.5 71.75,63.5 75.56,59.69 U2.15
N$51
  Bottom 0.254: IC4.6 62.55,58.74 65.25,58.74 67.47,60.96 71.75,60.96 75.56,57.15 U2.14
N$52
  Bottom 0.254: U2.13 72.71,54.61 68.9,58.42 67.47,58.42 65.25,56.2 62.55,56.2 IC4.5
N$53
  Bottom 0.254: IC4.4 62.55,53.5 67.31,53.5 67.47,53.34 74.3,53.34 75.56,52.07 U2.12
N$54
  Bottom 0.254: IC4.3 62.55,50.96 67.31,50.96 67.47,50.8 74.3,50.8 75.56,49.53 U2.11
N$55
  Bottom 0.254: U2.19 75.88,69.85 77.63,68.1 77.63,61.44 82.23,56.83 82.23,43.97 R10.2
N$56
  Bottom 0.254: 75.01,71.2 75.09,71.12 76.2,71.12 82.23,65.09 82.23,59.21 R10.1 | 75.01,71.2 74.3,71.91 74.3,72.87 75.09,73.66 76.2,73.66 89.85,60.01 91.92,60.01 C6.1 | U2.4 73.82,64.77 75.09,63.5 76.2,63.5 76.99,64.29 76.99,67.79 76.2,68.58 75.09,68.58 74.3,69.37 74.3,70.48 75.01,71.2
N$57
  Bottom 0.254: C7.+ 88.9,70.01 93.98,75.09 95.73,75.09 | 95.73,75.09 98.9,75.09 R11.2 | 95.73,75.09 95.73,71.91 93.34,69.53 93.34,67.15 94.61,65.88 94.61,58.58 88.9,52.86 87.95,52.86 87.15,53.66 87.15,54.61 88.27,55.72 88.27,56.52 Q1.3
N$58
  Top 0.508: R17.2 89.15,76.71 89.15,74.17 C7.-
  Bottom 0.254: R17.2 107.95,67.94 98.27,58.26 98.27,55.24 97.16,54.13 Q2.2
N$59
  Bottom 0.508: 14.13,73.34 14.13,73.66 U$1.TIP 15.24,72.64 15.24,65.79 16.89,64.14 24.92,64.14 26.35,65.56 26.35,67.15 20.8,72.71 20.8,75.56 S2.3
N$60
  Bottom 0.254: 92.71,67.63 92.71,63.34 93.98,62.07 93.98,59.05 89.06,54.13 88.42,54.13 Q1.2 | 92.71,67.63 92.71,69.85 94.46,71.6 94.46,73.82 C8.- | R18.2 103.82,82.55 97,75.72 93.66,75.72 87.79,69.85 87.79,68.26 88.42,67.63 92.71,67.63
VOUT+
  Bottom 0.508: VOUT+.P$1 148.59,53.98 144.15,53.98 141.29,56.83 R8.2 141.13,57.63 141.13,56.99 137,52.86 D5.C 136.68,52.7 132.87,48.9 125.73,48.9 C4.+ 125.57,48.58 124.94,48.58 120.49,44.13 115.73,44.13 113.98,42.39 IC1.2 | R1.2 87.95,24.61 93.5,24.61 D4.A 94.14,23.65 94.14,15.72 92.71,14.29 92.71,13.02 93.5,12.22 94.93,12.22 109.38,26.67 109.38,36.67 113.67,40.96 113.67,41.75 IC1.2 | R3.2 97.31,30.8 110.65,44.13 111.92,44.13 113.82,42.23 113.82,41.91 IC1.2
VOUT-
  Top 0.508: R4.2 52.83,24.89 52.83,17.27 42.55,6.99 34.67,6.99 R13.2
  Bottom 0.508: R13.2 34.61,6.99 126.21,6.99 138.43,19.21 D8.A 138.43,18.89 142.88,18.89 R9.1 143.03,19.05 143.67,19.68 | 143.67,19.68 148.27,24.29 148.27,25.4 C5.- | 143.67,19.68 148.59,14.76 VOUT-.P$1 | R4.2 53.34,27.94 D7.C 50.16,31.43 50.16,36.51 55.24,41.59 65.09,41.59 LM337.3